# EAGLE design Sch2 (EAGLE 7.5.0)
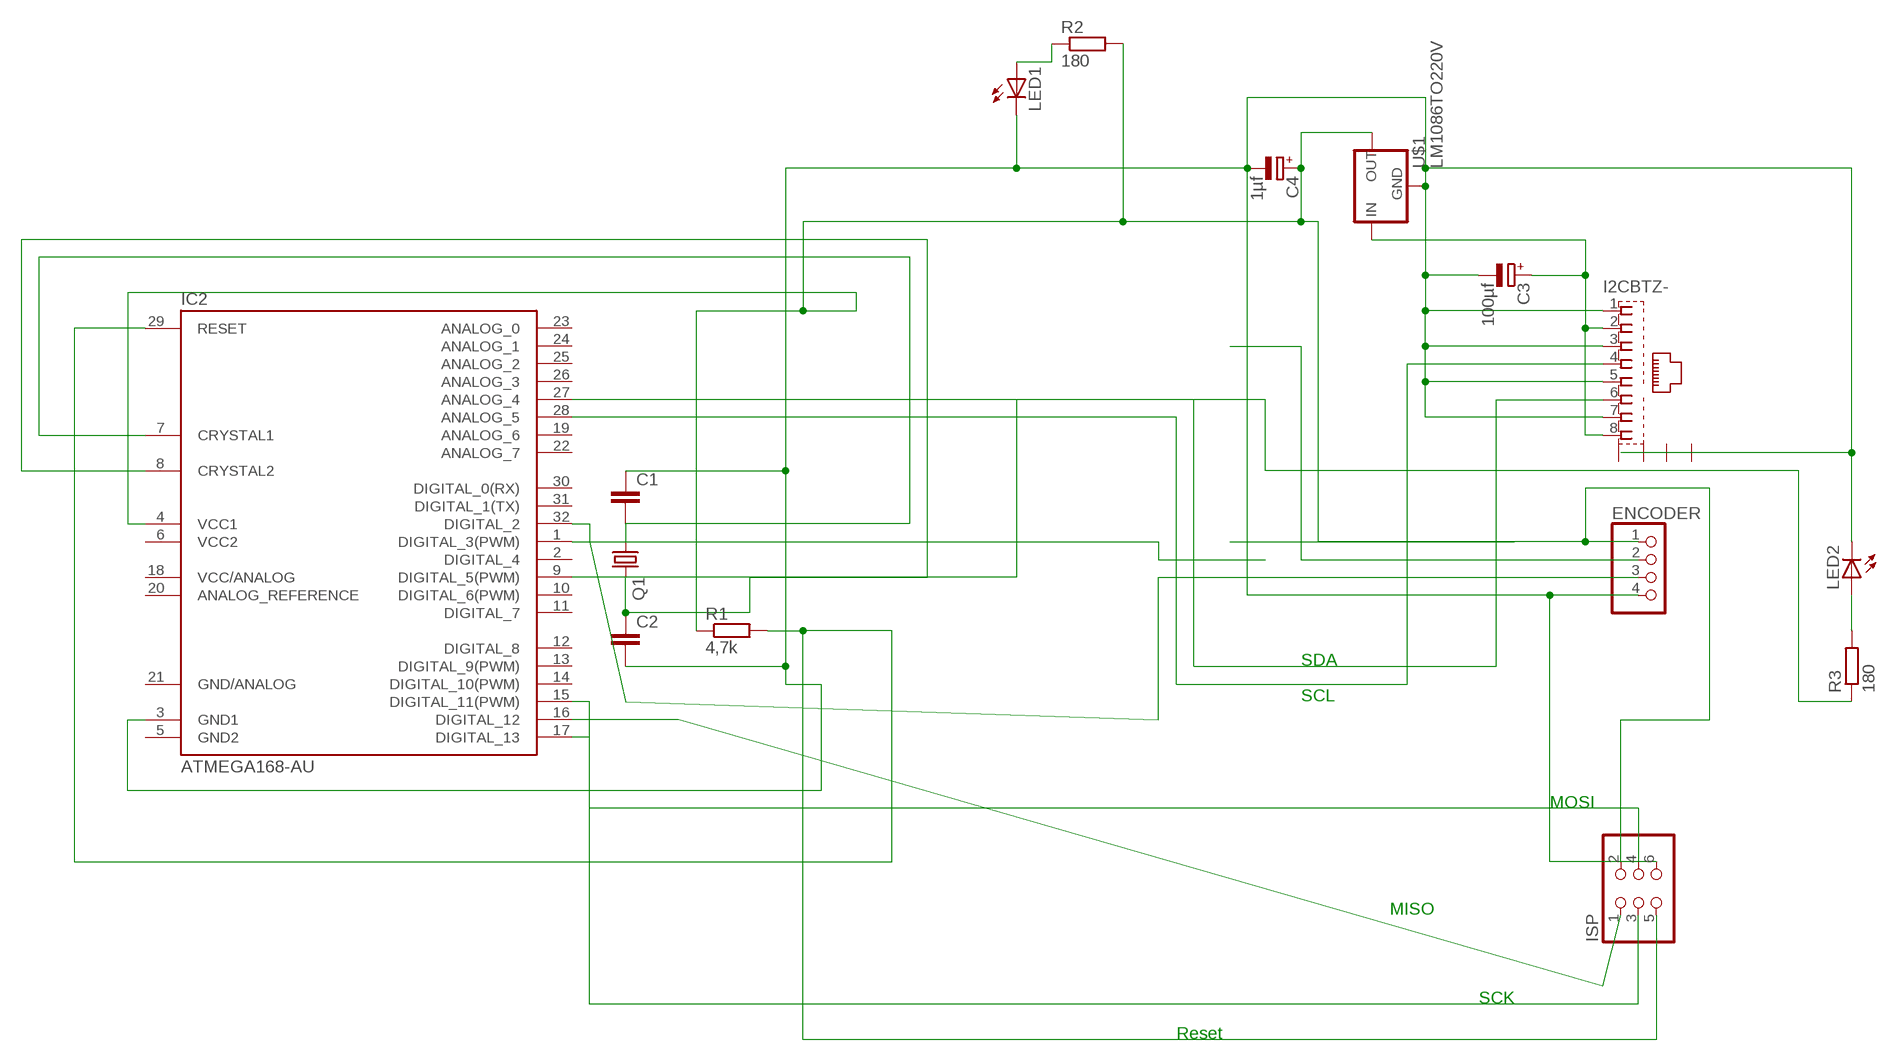
[diagram p0: schematic, sheet 1]

## Parts
C1  C-EU025-025X050  [C025-025X050]
C2  C-EU025-025X050  [C025-025X050]
C3  100µf  CPOL-EUE2.5-6  [E2,5-6]
C4  1µf  CPOL-EUE2.5-6  [E2,5-6]
ENCODER  PINHD-1X4  [1X04]
I2CBTZ  RJ45  [RJ45]
IC2  ATMEGA168-AU  [TQFP32-08]
ISP  PINHD-2X3  [2X03]
LED1  LED5MM  [LED5MM]
LED2  LED5MM  [LED5MM]
Q1  CRYSTALHC49S  [HC49/S]
R1  4,7k  R-EU_0204/7  [0204/7]
R2  180  R-EU_0204/7  [0204/7]
R3  180  R-EU_0204/7  [0204/7]
U$1  LM1086TO220V  [TO220S]

## Nets
N$1: LED2.A R3.2
N$2: IC2.29(RESET) ISP.5 R1.2
N$3: C4.+ ENCODER.1 IC2.4(VCC1) ISP.2 R1.1 R2.2 U$1.2(OUT)
N$4: C3.+ I2CBTZ.2 I2CBTZ.8 U$1.3(IN)
N$5: C1.2 IC2.7(CRYSTAL1) Q1.1
N$6: I2CBTZ.4 IC2.28(ANALOG_5)
N$7: I2CBTZ.6 IC2.27(ANALOG_4)
N$8: C2.1 IC2.8(CRYSTAL2) Q1.2
N$9: ENCODER.2
N$10: ENCODER.3 IC2.1(DIGITAL_3(PWM))
N$11: IC2.32(DIGITAL_2)
N$12: C1.1 C2.2 C3.- C4.- ENCODER.4 I2CBTZ.1 I2CBTZ.3 I2CBTZ.5 I2CBTZ.7 IC2.3(GND1) ISP.6 LED1.K(C) LED2.K(C) U$1.1(GND)
N$13: IC2.17(DIGITAL_13) ISP.3
N$15: IC2.9(DIGITAL_5(PWM)) R3.1
N$16: LED1.A R2.1
N$19: IC2.16(DIGITAL_12) ISP.1
N$20: IC2.15(DIGITAL_11(PWM)) ISP.4
Unconnected: I2CBTZ.G1 I2CBTZ.G2 I2CBTZ.G3 I2CBTZ.G4 IC2.2(DIGITAL_4) IC2.10(DIGITAL_6(PWM)) IC2.11(DIGITAL_7) IC2.12(DIGITAL_8) IC2.13(DIGITAL_9(PWM)) IC2.14(DIGITAL_10(PWM)) IC2.18(VCC/ANALOG) IC2.19(ANALOG_6) IC2.20(ANALOG_REFERENCE) IC2.22(ANALOG_7) IC2.23(ANALOG_0) IC2.24(ANALOG_1) IC2.25(ANALOG_2) IC2.26(ANALOG_3) IC2.30(DIGITAL_0(RX)) IC2.31(DIGITAL_1(TX))

## Notes on the sheet
- SDA
- SCL
- MOSI
- MISO
- SCK
- Reset

## Power pins joined to a net without a drawn wire
GND2: IC2.5(GND2)
GND/ANALOG: IC2.21(GND/ANALOG)
VCC2: IC2.6(VCC2)

## Library data of the parts
C1 C2 = rcl:C-EU: CAPACITOR, European symbol
C3 C4 = rcl:CPOL-EU: POLARIZED CAPACITOR, European symbol
ENCODER = pinhead:PINHD-1X4: PIN HEADER
I2CBTZ = con-appsys:RJ45: AMP connector
IC2 = Arduino-AVR:ATMEGA168
ISP = pinhead:PINHD-2X3: PIN HEADER
LED1 LED2 = led:LED: LED OSRAM: - CHIPLED LG R971, LG N971, LY N971, LG Q971, LY Q971, LO R971, LY R971 LH N974, LH R974 LS Q976, LO Q976, LY Q976 LO Q996 - Hyper CHIPLED LW Q18S LB Q993, LB Q99A, LB R99A - SideLED LS A670, LO A670, LY A670, LG A670, LP A670 LB A673, LV A673, LT A673, LW A673 LH A674 LY A675 LS A676, LA A676, LO A676, LY A676, LW A676 LS A679, LY A679, LG A679 - Hyper Micro SIDELED® LS Y876, LA Y876, LO Y876, LY Y876 LT Y87S - SmartLED LW L88C, LW L88S LB L89C, LB L89S, LG L890 LS L89K, LO L89K, LY L89K LS L896, LA L896, LO L896, LY L896 - TOPLED LS T670, LO T670, LY T670, LG T670, LP T670 LSG T670, LSP T670, LSY T670, LOP T670, LYG T670 LG T671, LOG T671, LSG T671 LB T673, LV T673, LT T673, LW T673 LH T674 LS T676, LA T676, LO T676, LY T676, LB T676, LH T676, LSB T676, LW T676 LB T67C, LV T67C, LT T67C, LS T67K, LO T67K, LY T67K, LW E67C LS E67B, LA E67B, LO E67B, LY E67B, LB E67C, LV E67C, LT E67C LW T67C LS T679, LY T679, LG T679 LS T770, LO T770, LY T770, LG T770, LP T770 LB T773, LV T773, LT T773, LW T773 LH T774 LS E675, LA E675, LY E675, LS T675 LS T776, LA T776, LO T776, LY T776, LB T776 LHGB T686 LT T68C, LB T68C - Hyper Mini TOPLED® LB M676 - Mini TOPLED Santana® LG M470 LS M47K, LO M47K, LY M47K Source: http://www.osram.convergy.de LUXEON: - LUMILED® LXK2-PW12-R00, LXK2-PW12-S00, LXK2-PW14-U00, LXK2-PW14-V00 LXK2-PM12-R00, LXK2-PM12-S00, LXK2-PM14-U00 LXK2-PE12-Q00, LXK2-PE12-R00, LXK2-PE12-S00, LXK2-PE14-T00, LXK2-PE14-U00 LXK2-PB12-K00, LXK2-PB12-L00, LXK2-PB12-M00, LXK2-PB14-N00, LXK2-PB14-P00, LXK2-PB14-Q00 LXK2-PR12-L00, LXK2-PR12-M00, LXK2-PR14-Q00, LXK2-PR14-R00 LXK2-PD12-Q00, LXK2-PD12-R00, LXK2-PD12-S00 LXK2-PH12-R00, LXK2-PH12-S00 LXK2-PL12-P00, LXK2-PL12-Q00, LXK2-PL12-R00 Source: www.luxeon.com KINGBRIGHT: KA-3528ASYC Source: www.kingbright.com
Q1 = crystal:CRYSTAL: CRYSTAL; OC_FARNELL: 1667008; OC_NEWARK: unknown
R1-R3 = rcl:R-EU_: RESISTOR, European symbol
U$1 = v-reg-2:LM1086

## Board
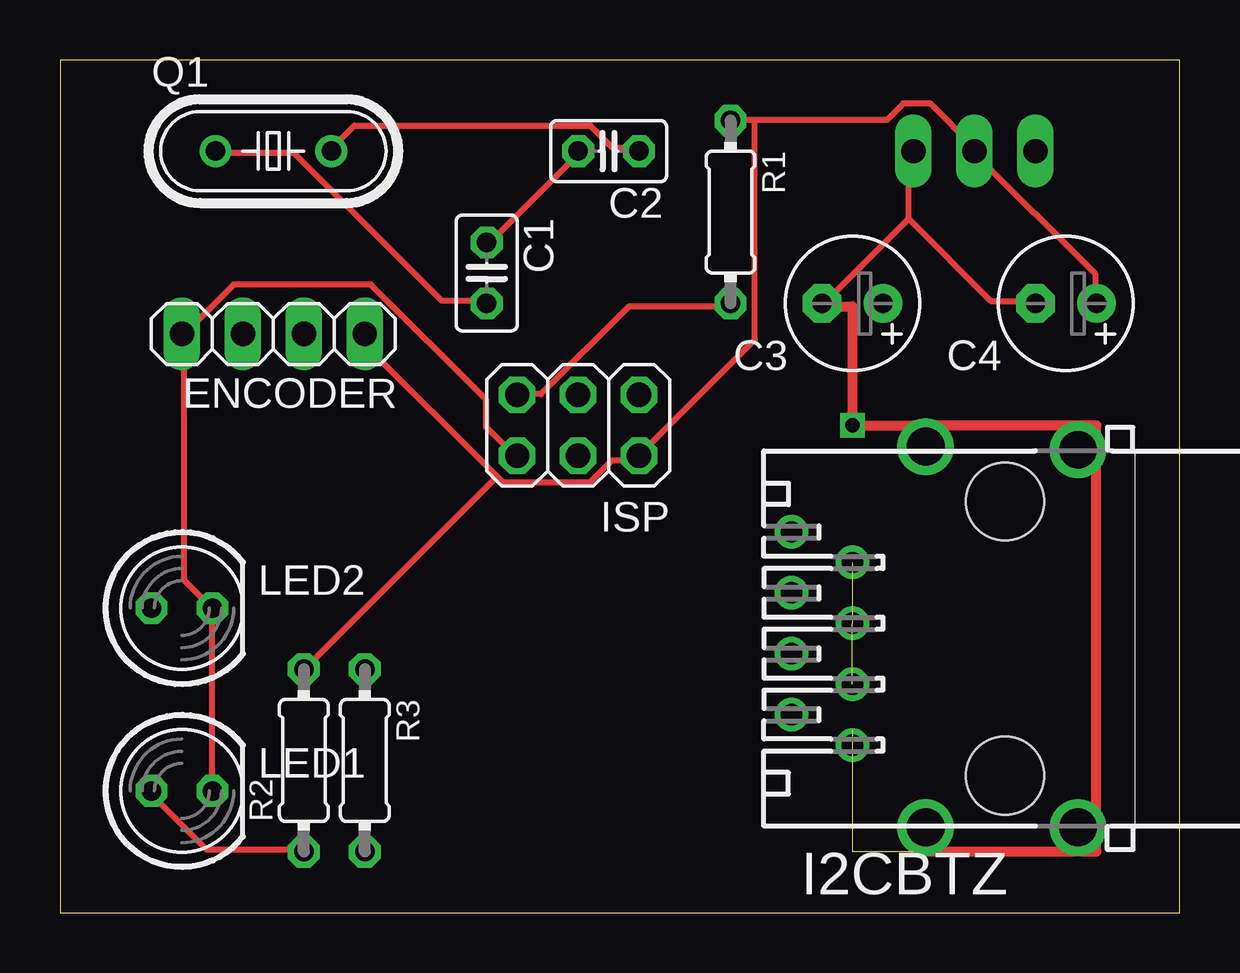
[diagram p1: board, top side]
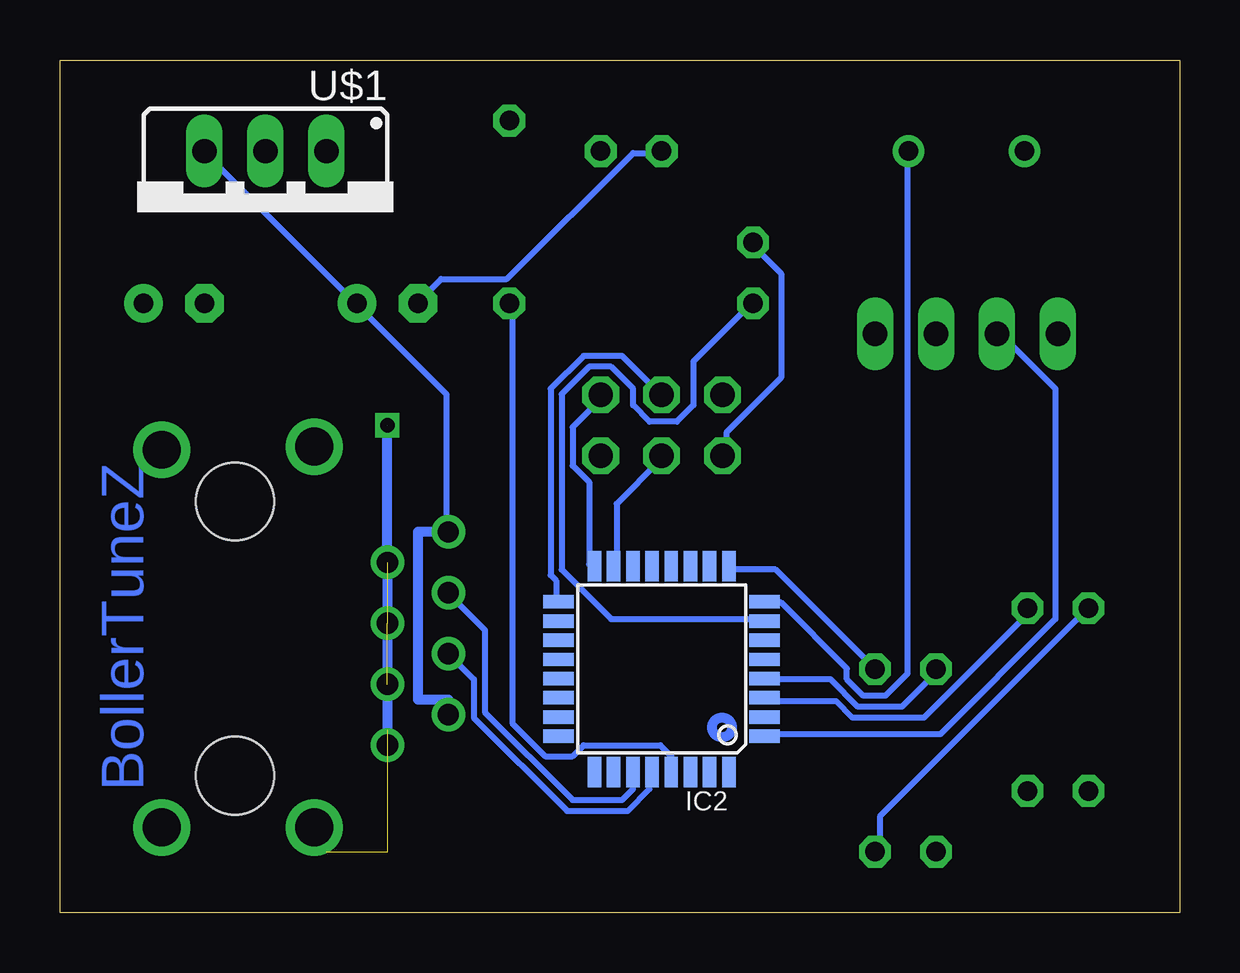
[diagram p2: board, bottom side, seen from below]

Size 46.66 x 35.55 mm. Coordinates in mm from the lower left corner, seen from the top.
Outline: 0,0 46.66,0 46.66,35.55 0,35.55 0,0
Copper layers (1*16): Top 0.035mm / dielectric 1.5mm / Bottom 0.035mm
Design rules "default": minimum track width 10mil, minimum drill 24mil, track to track 8mil, track to pad 8mil, pad to pad 8mil, via to via 8mil, smd to smd 8mil, copper to edge 40mil, drill to drill 8mil, minimum pad ring 10mil, minimum via ring 8mil, stop-mask expansion 4mil, vias tented up to drill 0mil, thermal gap 10mil

### Footprints (pad centres in the part's own frame; a part is rotated, then mirrored left to right if it is on the bottom)
C025-025X050 = drill 0.813 octagon: 1 -1.27,0; 2 1.27,0
E2,5-6 = drill 0.813 pad 1.6: + -1.27,0 | drill 0.813 pad 1.6 octagon: - 1.27,0
1X04 = drill 1.016 long: 1 -3.81,0; 2 -1.27,0; 3 1.27,0; 4 3.81,0
RJ45 = drill 0.889: 1 -4.445,6.35; 2 -3.175,8.89; 3 -1.905,6.35; 4 -0.635,8.89; 5 0.635,6.35; 6 1.905,8.89; 7 3.175,6.35; 8 4.445,8.89 | drill 1.575 pad 2.184: G1 -7.874,-3.048; G2 7.874,-3.048; G3 -7.874,3.302; G4 8.001,3.302 | hole 3.251: -5.715,0; 5.715,0
TQFP32-08 = smd 1.27 x 0.559: 1 -4.293,2.8; 2 -4.293,2; 3 -4.293,1.2; 4 -4.293,0.4; 5 -4.293,-0.4; 6 -4.293,-1.2; 7 -4.293,-2; 8 -4.293,-2.8; 17 4.293,-2.8; 18 4.293,-2; 19 4.293,-1.2; 20 4.293,-0.4; 21 4.293,0.4; 22 4.293,1.2; 23 4.293,2; 24 4.293,2.8 | smd 0.559 x 1.27: 9 -2.8,-4.293; 10 -2,-4.293; 11 -1.2,-4.293; 12 -0.4,-4.293; 13 0.4,-4.293; 14 1.2,-4.293; 15 2,-4.293; 16 2.8,-4.293; 25 2.8,4.293; 26 2,4.293; 27 1.2,4.293; 28 0.4,4.293; 29 -0.4,4.293; 30 -1.2,4.293; 31 -2,4.293; 32 -2.8,4.293
2X03 = drill 1.016 octagon: 1 -2.54,-1.27; 2 -2.54,1.27; 3 0,-1.27; 4 0,1.27; 5 2.54,-1.27; 6 2.54,1.27
LED5MM = drill 0.813 octagon: A -1.27,0; K 1.27,0
HC49/S = drill 0.813: 1 -2.413,0; 2 2.413,0
0204/7 = drill 0.813 octagon: 1 -3.81,0; 2 3.81,0
TO220S = drill 1.016 long: 1 -2.54,-2.54; 2 0,-2.54; 3 2.54,-2.54

### Placement (x,y rotation side)
C1  17.78,26.67 270 top
C2  22.86,31.75 180 top
C3  33.02,25.4 180 top
C4  41.91,25.4 180 top
ENCODER  8.89,24.13 180 top
I2CBTZ  39.37,11.43 90 top
IC2  21.59,10.16 180 bottom
ISP  21.59,20.32 180 top
LED1  5.08,5.08 0 top
LED2  5.08,12.7 0 top
Q1  8.89,31.75 0 top
R1  27.94,29.21 270 top
R2  10.16,6.35 90 top
R3  12.7,6.35 270 top
U$1  38.1,29.21 180 bottom

### Tracks (layer width: path | path; a pad name or v marks a point on that pad's centre or on a via)
N$1
  Bottom 0.254: LED2.A 12.5,4.01 12.5,2.64 R3.2
N$2
  Top 0.254: ISP.5 19.13,21.61 20.04,21.61 23.7,25.27 27.81,25.27 R1.2
  Bottom 0.254: IC2.29 21.18,6.07 21.18,6.53 21.64,6.98 24.84,6.98 25.3,6.53 26.44,6.53 27.81,7.9 27.81,25.27 R1.2
N$3
  Top 0.254: 28.96,33.05 34.44,33.05 35.13,33.73 36.27,33.73 38.1,31.9 U$1.2 38.1,31.67 43.13,26.64 43.13,25.5 C4.+ | 28.96,33.05 28.04,33.05 R1.1 | 18.21,18.19 12.72,23.67 12.72,24.13 ENCODER.1 | 18.21,18.19 18.44,17.96 22.1,17.96 23.01,18.87 23.93,18.87 ISP.2 24.16,19.1 28.96,23.9 28.96,33.05 | 18.21,18.19 10.21,10.18 R2.2
  Bottom 0.254: IC2.4 17.3,9.73 14.55,9.73 13.41,8.59 11.58,8.59 10.21,9.96 R2.2
N$4
  Bottom 0.254: U$1.3 40.61,31.67 34.44,25.5 C3.+ 34.21,25.27 30.56,21.61 30.56,15.9 I2CBTZ.8
  Bottom 0.406: I2CBTZ.8 31.75,15.88 31.75,8.89 30.48,8.89 I2CBTZ.2
N$5
  Top 0.254: Q1.1 6.55,31.67 9.75,31.67 15.93,25.5 17.75,25.5 C1.2
  Bottom 0.254: IC2.7 17.3,12.24 23.7,12.24 25.76,14.3 25.76,21.61 24.61,22.76 23.7,22.76 22.78,21.84 22.78,21.16 22.1,20.47 20.95,20.47 20.27,21.16 20.27,22.99 17.98,25.27 C1.2
N$6
  Bottom 0.254: I2CBTZ.4 29.41,9.73 29.41,8.13 25.53,4.24 23.01,4.24 22.1,5.16 22.1,5.84 IC2.28
N$7
  Bottom 0.254: IC2.27 22.78,5.84 22.78,5.16 23.24,4.7 25.3,4.7 28.96,8.36 28.96,11.79 30.33,13.16 I2CBTZ.6
N$8
  Top 0.254: C2.1 23.93,31.9 23.01,31.9 22.1,32.82 12.27,32.82 11.35,31.9 Q1.2
  Bottom 0.254: IC2.8 17.3,12.93 16.61,12.93 13.87,10.18 13.87,9.73 13.18,9.04 12.27,9.04 11.35,9.96 11.35,31.67 Q1.2
N$10
  Bottom 0.254: IC2.1 17.3,7.44 9.98,7.44 5.18,12.24 5.18,21.84 7.47,24.13 ENCODER.3
N$12  (3 unrouted)
  Top 0.254: 6.32,12.7 6.32,5.16 LED1.K | 5.18,24.13 5.18,13.84 6.32,12.7 | 6.32,12.7 LED2.K | C1.1 17.98,28.02 21.64,31.67 C2.2 | 35.36,28.93 35.36,31.67 U$1.1 | 35.36,28.93 31.93,25.5 C3.- 31.93,25.27 | 35.36,28.93 38.79,25.5 40.61,25.5 C4.- | 5.18,24.13 7.24,26.19 12.95,26.19 17.75,21.39 17.75,20.24 18.9,19.1 ISP.6 | 5.18,24.13 ENCODER.4
  Top 0.406: 31.93,25.27 33.02,25.27 33.02,20.32 35.56,20.32
  Bottom 0.254: IC2.3 17.3,8.81 14.33,8.81 13.64,8.13 10.67,8.13 6.55,12.24 6.55,12.7 LED2.K | ISP.6 18.9,19.1 18.9,20.02 16.61,22.3 16.61,26.64 17.75,27.79 C1.1 | C2.2 21.64,31.67 22.78,31.67 28.04,26.42 30.78,26.42 31.7,25.5 C3.-
  Bottom 0.406: 33.02,20.32 I2CBTZ.7 I2CBTZ.1
N$13
  Bottom 0.254: IC2.17 25.98,13.16 25.98,13.84 26.21,14.07 26.21,21.84 24.84,23.22 23.24,23.22 21.64,21.61 ISP.3
N$15
  Bottom 0.254: R3.1 16.84,14.3 18.67,14.3 IC2.9
N$16
  Top 0.254: R2.1 9.98,2.64 6.1,2.64 3.81,4.93 LED1.A
N$17  (2 unrouted)
  Top 0.406: 35.56,20.32 43.18,20.32 43.18,2.54 35.56,2.54
N$19
  Bottom 0.254: IC2.16 24.61,14.53 24.61,17.96 25.3,18.64 25.3,20.24 24.16,21.39 ISP.1
N$20
  Bottom 0.254: IC2.15 23.47,14.53 23.47,17.04 21.64,18.87 ISP.4
N$21  (via drill 0.6)
  other vias: 33.02,20.32
(copper drawn outside any net)
  shapes: Bottom circle x1

### Text on the board
Bottom: BollerTuneZ